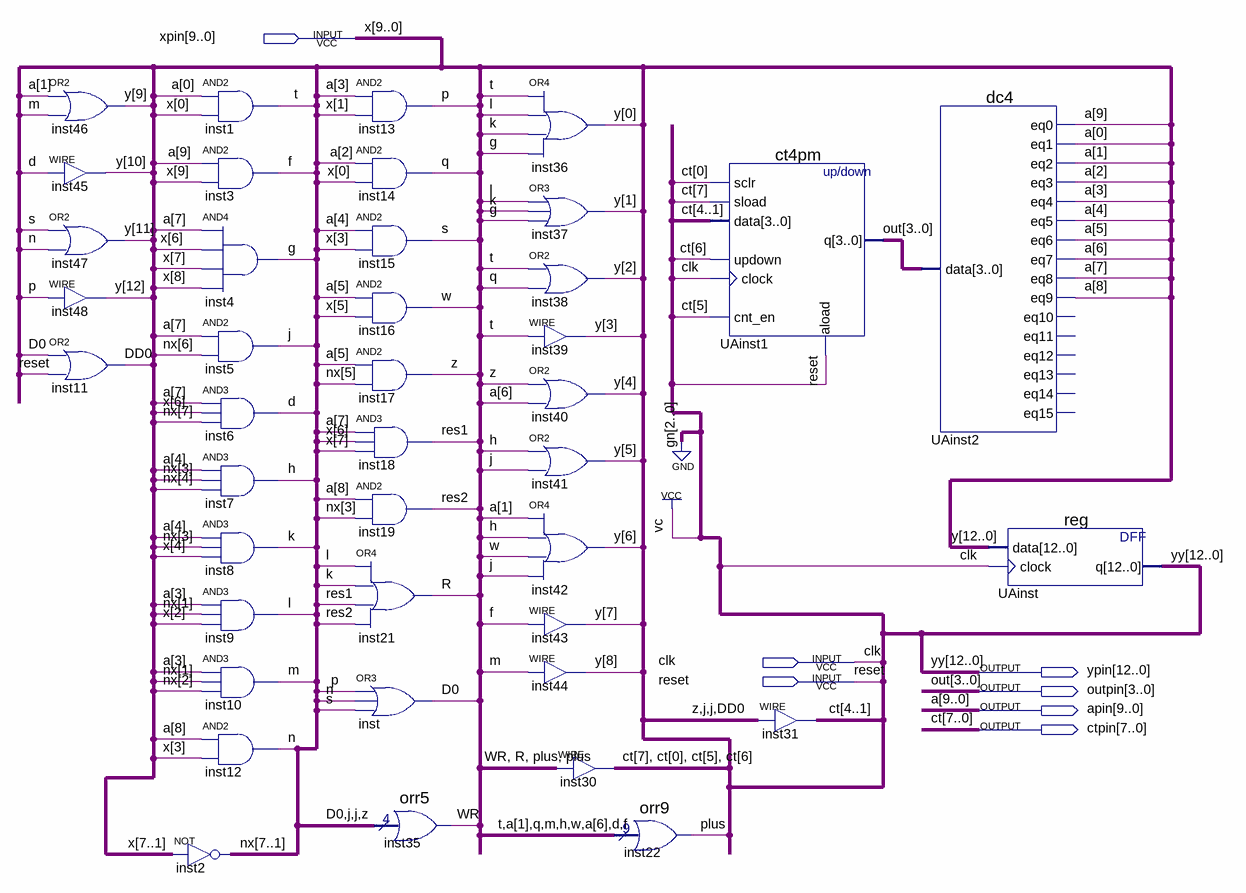
[diagram p0: schematic sheet]
// Quartus schematic UA.bdf as structural Verilog: 41 symbols, 7 pins
module UA (
  input  [9:0] xpin,
  input  clk,
  input  reset,
  output [12:0] ypin,
  output [3:0] outpin,
  output [9:0] apin,
  output [7:0] ctpin
);

  wire d, D0, DD0, f, g, h, j, k, l, m, n, p, plus, q, R, res1, res2, s, t, w, WR, z;
  wire [7:1] nx;
  wire [12:0] y;

  or inst46 (y[9], apin[1], m);
  assign y[10] = d;  // WIRE inst45
  or inst47 (y[11], s, n);
  assign y[12] = p;  // WIRE inst48
  or inst11 (DD0, D0, reset);
  and inst1 (t, apin[0], xpin[0]);
  and inst3 (f, apin[9], xpin[9]);
  and inst4 (g, apin[7], xpin[6], xpin[7], xpin[8]);
  and inst5 (j, apin[7], nx[6]);
  and inst6 (d, apin[7], xpin[6], nx[7]);
  and inst7 (h, apin[4], nx[3], nx[4]);
  and inst8 (k, apin[4], nx[3], xpin[4]);
  and inst9 (l, apin[3], nx[1], xpin[2]);
  and inst10 (m, apin[3], nx[1], nx[2]);
  and inst12 (n, apin[8], xpin[3]);
  assign nx = ~xpin[7:1];  // NOT inst2, 7 bits wide
  and inst13 (p, apin[3], xpin[1]);
  and inst14 (q, apin[2], xpin[0]);
  and inst15 (s, apin[4], xpin[3]);
  and inst16 (w, apin[5], xpin[5]);
  and inst17 (z, apin[5], nx[5]);
  and inst18 (res1, apin[7], xpin[6], xpin[7]);
  and inst19 (res2, apin[8], nx[3]);
  or inst21 (R, l, k, res1, res2);
  or inst (D0, p, n, s);
  orr5 inst35 (.data({D0, {2{j}}, z}), .result(WR));
  or inst36 (y[0], t, l, k, g);
  or inst37 (y[1], l, k, g);
  or inst38 (y[2], t, q);
  assign y[3] = t;  // WIRE inst39
  or inst40 (y[4], z, apin[6]);
  or inst41 (y[5], h, j);
  or inst42 (y[6], apin[1], h, w, j);
  assign y[7] = f;  // WIRE inst43
  assign y[8] = m;  // WIRE inst44
  assign {ctpin[7], ctpin[0], ctpin[5], ctpin[6]} = {WR, R, {2{plus}}};  // WIRE inst30
  orr9 inst22 (.data({t, apin[1], q, m, h, w, apin[6], d, f}), .result(plus));
  ct4pm UAinst1 (
    .sclr(ctpin[0]), .sload(ctpin[7]), .data(ctpin[4:1]), .updown(ctpin[6]), .clock(clk), .cnt_en(ctpin[5]),
    .aload(reset), .q(outpin));
  assign ctpin[4:1] = {z, {2{j}}, DD0};  // WIRE inst31
  dc4 UAinst2 (
    .data(outpin), .eq0(apin[9]), .eq1(apin[0]), .eq2(apin[1]), .eq3(apin[2]), .eq4(apin[3]), .eq5(apin[4]),
    .eq6(apin[5]), .eq7(apin[6]), .eq8(apin[7]), .eq9(apin[8]));  // open: eq10, eq11, eq12, eq13, eq14, eq15
  \reg  UAinst (.data(y), .clock(clk), .q(ypin));

  // Other names for the same wires on the sheet: a[9:0] = apin; ct[7:0] = ctpin; out[3:0] = outpin; x[9:0] = xpin;
  //   yy[12:0] = ypin
endmodule
